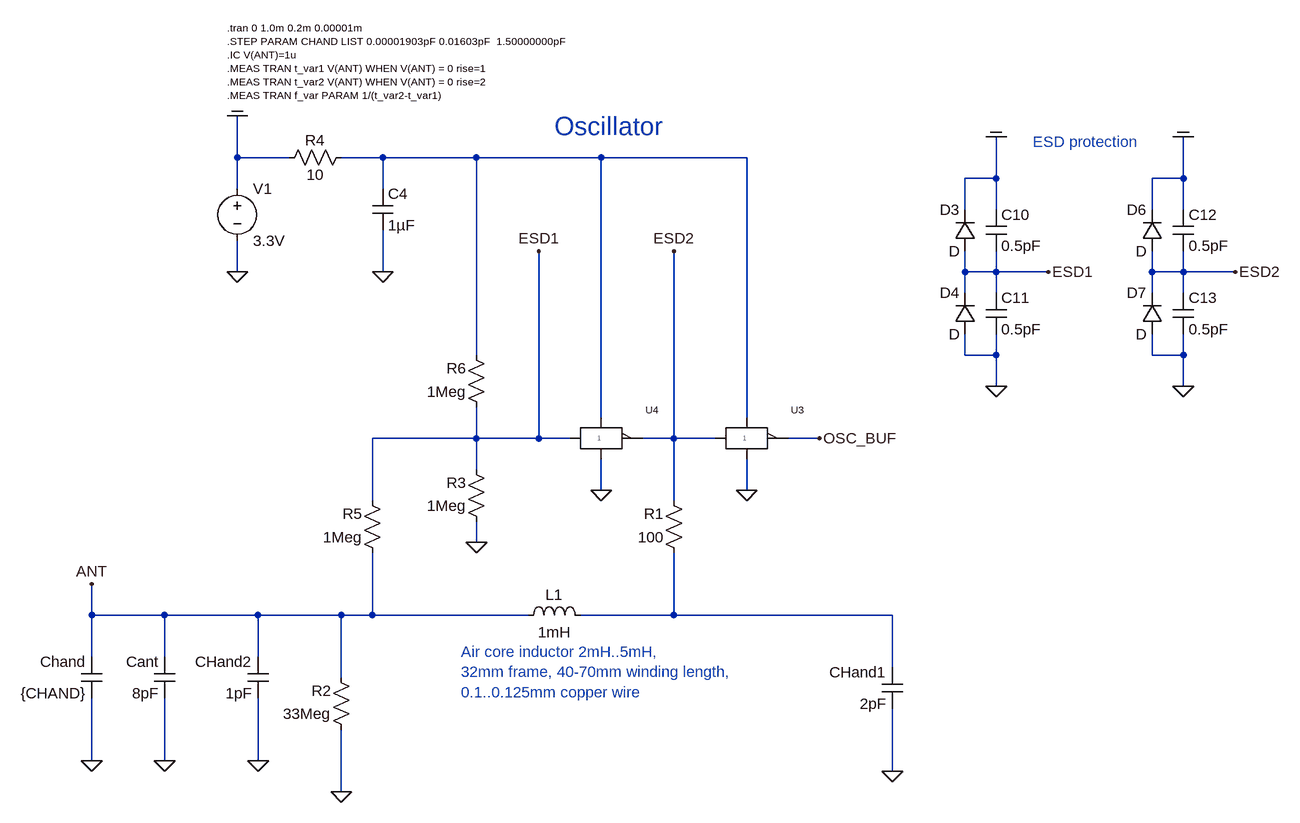
[diagram p0: schematic 2020_2g04_oscill_v02.asc]
2020_2g04_oscill_v02.asc, the LTspice schematic file:
Version 4
SHEET 1 2908 1588
WIRE -1056 -336 -1056 -400
WIRE -976 -336 -1056 -336
WIRE -832 -336 -896 -336
WIRE -688 -336 -832 -336
WIRE -496 -336 -688 -336
WIRE -272 -336 -496 -336
WIRE 112 -304 112 -368
WIRE 112 -304 64 -304
WIRE 400 -304 400 -368
WIRE 400 -304 352 -304
WIRE -1056 -288 -1056 -336
WIRE -832 -288 -832 -336
WIRE 64 -256 64 -304
WIRE 112 -256 112 -304
WIRE 352 -256 352 -304
WIRE 400 -256 400 -304
WIRE -1056 -160 -1056 -208
WIRE -832 -160 -832 -224
WIRE 64 -160 64 -192
WIRE 112 -160 112 -192
WIRE 112 -160 64 -160
WIRE 192 -160 112 -160
WIRE 352 -160 352 -192
WIRE 400 -160 400 -192
WIRE 400 -160 352 -160
WIRE 480 -160 400 -160
WIRE 64 -128 64 -160
WIRE 112 -128 112 -160
WIRE 352 -128 352 -160
WIRE 400 -128 400 -160
WIRE -688 -32 -688 -336
WIRE 64 -32 64 -64
WIRE 112 -32 112 -64
WIRE 112 -32 64 -32
WIRE 352 -32 352 -64
WIRE 400 -32 400 -64
WIRE 400 -32 352 -32
WIRE 112 16 112 -32
WIRE 400 16 400 -32
WIRE -496 64 -496 -336
WIRE -272 64 -272 -336
WIRE -688 96 -688 48
WIRE -688 96 -848 96
WIRE -592 96 -592 -192
WIRE -592 96 -688 96
WIRE -544 96 -592 96
WIRE -384 96 -384 -192
WIRE -384 96 -432 96
WIRE -320 96 -384 96
WIRE -160 96 -208 96
WIRE -688 144 -688 96
WIRE -496 176 -496 128
WIRE -272 176 -272 128
WIRE -848 192 -848 96
WIRE -384 192 -384 96
WIRE -688 256 -688 224
WIRE -1280 368 -1280 320
WIRE -1168 368 -1280 368
WIRE -1024 368 -1168 368
WIRE -896 368 -1024 368
WIRE -848 368 -848 272
WIRE -848 368 -896 368
WIRE -608 368 -848 368
WIRE -384 368 -384 272
WIRE -384 368 -528 368
WIRE -48 368 -384 368
WIRE -1280 432 -1280 368
WIRE -1168 432 -1168 368
WIRE -1024 432 -1024 368
WIRE -48 448 -48 368
WIRE -896 464 -896 368
WIRE -1280 592 -1280 496
WIRE -1168 592 -1168 496
WIRE -1024 592 -1024 496
WIRE -48 608 -48 512
WIRE -896 640 -896 544
FLAG -1056 -160 0
FLAG -1280 592 0
FLAG -1280 320 ANT
FLAG -1056 -400 COM
FLAG 112 16 0
FLAG 112 -368 COM
FLAG 192 -160 ESD1
FLAG 400 16 0
FLAG 400 -368 COM
FLAG 480 -160 ESD2
FLAG -1168 592 0
FLAG -592 -192 ESD1
FLAG -160 96 OSC_BUF
FLAG -832 -160 0
FLAG -384 -192 ESD2
FLAG -272 176 0
FLAG -496 176 0
FLAG -896 640 0
FLAG -688 256 0
FLAG -1024 592 0
FLAG -48 608 0
SYMBOL voltage -1056 -304 R0
WINDOW 123 0 0 Left 2
WINDOW 39 0 0 Left 2
SYMATTR InstName V1
SYMATTR Value 3.3V
SYMBOL ind -512 384 M270
WINDOW 0 32 56 VTop 2
WINDOW 3 5 56 VBottom 2
SYMATTR InstName L1
SYMATTR Value 1mH
SYMATTR SpiceLine Ipk=0.1 Rser=101 Rpar=2Meg Cpar=1.286pF
SYMBOL cap -1264 432 M0
SYMATTR InstName Chand
SYMATTR Value {CHAND}
SYMBOL diode 80 -192 R180
WINDOW 0 24 64 Left 2
WINDOW 3 24 0 Left 2
SYMATTR InstName D3
SYMBOL diode 80 -64 R180
WINDOW 0 24 64 Left 2
WINDOW 3 24 0 Left 2
SYMATTR InstName D4
SYMBOL cap 96 -256 R0
SYMATTR InstName C10
SYMATTR Value 0.5pF
SYMBOL cap 96 -128 R0
SYMATTR InstName C11
SYMATTR Value 0.5pF
SYMBOL diode 368 -192 R180
WINDOW 0 24 64 Left 2
WINDOW 3 24 0 Left 2
SYMATTR InstName D6
SYMBOL diode 368 -64 R180
WINDOW 0 24 64 Left 2
WINDOW 3 24 0 Left 2
SYMATTR InstName D7
SYMBOL cap 384 -256 R0
SYMATTR InstName C12
SYMATTR Value 0.5pF
SYMBOL cap 384 -128 R0
SYMATTR InstName C13
SYMATTR Value 0.5pF
SYMBOL cap -1152 432 M0
SYMATTR InstName Cant
SYMATTR Value 8pF
SYMBOL res -880 -352 R90
WINDOW 0 5 56 VBottom 2
WINDOW 3 27 56 VTop 2
SYMATTR InstName R4
SYMATTR Value 10
SYMBOL cap -848 -288 R0
SYMATTR InstName C4
SYMATTR Value 1µF
SYMBOL SBORKA\\Logika\\74AHC1G04 -272 48 R0
SYMATTR InstName U3
SYMBOL SBORKA\\Logika\\74AHC1G04 -496 48 R0
SYMATTR InstName U4
SYMBOL res -832 288 R180
WINDOW 0 31 76 Left 2
WINDOW 3 31 40 Left 2
SYMATTR InstName R5
SYMATTR Value 1Meg
SYMBOL res -368 288 R180
WINDOW 0 31 76 Left 2
WINDOW 3 31 40 Left 2
SYMATTR InstName R1
SYMATTR Value 100
SYMBOL res -880 560 R180
WINDOW 0 31 76 Left 2
WINDOW 3 31 40 Left 2
SYMATTR InstName R2
SYMATTR Value 33Meg
SYMBOL res -672 240 R180
WINDOW 0 31 76 Left 2
WINDOW 3 31 40 Left 2
SYMATTR InstName R3
SYMATTR Value 1Meg
SYMBOL res -672 64 R180
WINDOW 0 31 76 Left 2
WINDOW 3 31 40 Left 2
SYMATTR InstName R6
SYMATTR Value 1Meg
SYMBOL cap -1008 432 M0
SYMATTR InstName CHand2
SYMATTR Value 1pF
SYMBOL cap -32 448 M0
SYMATTR InstName CHand1
SYMATTR Value 2pF
TEXT -1072 -536 Left 1 !.tran 0 1.0m 0.2m 0.00001m\n.STEP PARAM CHAND LIST 0.00001903pF 0.01603pF  1.50000000pF\n.IC V(ANT)=1u\n.MEAS TRAN t_var1 V(ANT) WHEN V(ANT) = 0 rise=1\n.MEAS TRAN t_var2 V(ANT) WHEN V(ANT) = 0 rise=2\n.MEAS TRAN f_var PARAM 1/(t_var2-t_var1)
TEXT 168 -360 Left 2 ;ESD protection
TEXT -568 -384 Left 4 ;Oscillator
TEXT -712 424 Left 2 ;Air core inductor 2mH..5mH, \n32mm frame, 40-70mm winding length, \n0.1..0.125mm copper wire

The netlist it stands for:
* 2020_2g04_oscill_v02.asc
V1 COM 0 3.3V
L1 N002 ANT 1mH Ipk=0.1 Rser=101 Rpar=2Meg Cpar=1.286pF
Chand ANT 0 {CHAND}
D3 ESD1 COM D
D4 0 ESD1 D
C10 COM ESD1 0.5pF
C11 ESD1 0 0.5pF
D6 ESD2 COM D
D7 0 ESD2 D
C12 COM ESD2 0.5pF
C13 ESD2 0 0.5pF
Cant ANT 0 8pF
R4 N001 COM 10
C4 N001 0 1µF
XU3 ESD2 OSC_BUF N001 0 74AHC1G04  ; pins in out vcc gnd
XU4 ESD1 ESD2 N001 0 74AHC1G04  ; pins in out vcc gnd
R5 ANT ESD1 1Meg
R1 N002 ESD2 100
R2 0 ANT 33Meg
R3 0 ESD1 1Meg
R6 ESD1 N001 1Meg
CHand2 ANT 0 1pF
CHand1 N002 0 2pF
.model D D
.lib standard.dio
.tran 0 1.0m 0.2m 0.00001m
.STEP PARAM CHAND LIST 0.00001903pF 0.01603pF  1.50000000pF
.IC V(ANT)=1u
.MEAS TRAN t_var1 V(ANT) WHEN V(ANT) = 0 rise=1
.MEAS TRAN t_var2 V(ANT) WHEN V(ANT) = 0 rise=2
.MEAS TRAN f_var PARAM 1/(t_var2-t_var1)
* ESD protection
* Oscillator
* Air core inductor 2mH..5mH,
* 32mm frame, 40-70mm winding length,
* 0.1..0.125mm copper wire
.lib 74AHC1G04.cir
.backanno
.end